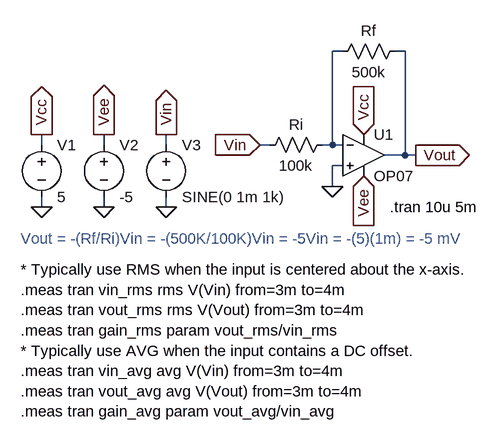
[diagram p0: schematic op-amp_inverting_amplifier.asc]
op-amp_inverting_amplifier.asc, the LTspice schematic file:
Version 4
SHEET 1 1552 680
WIRE 416 160 400 160
WIRE 512 160 496 160
WIRE -48 304 -48 288
WIRE 48 304 48 288
WIRE 144 304 144 288
WIRE 304 304 288 304
WIRE 400 304 400 160
WIRE 400 304 384 304
WIRE 416 304 400 304
WIRE 512 320 512 160
WIRE 512 320 480 320
WIRE 528 320 512 320
WIRE 416 336 400 336
WIRE 400 368 400 336
WIRE -48 400 -48 384
WIRE 48 400 48 384
WIRE 144 400 144 384
FLAG 448 288 Vcc
IOPIN 448 288 In
FLAG 448 352 Vee
IOPIN 448 352 In
FLAG 288 304 Vin
IOPIN 288 304 In
FLAG 528 320 Vout
IOPIN 528 320 Out
FLAG -48 400 0
FLAG 48 400 0
FLAG 144 400 0
FLAG -48 288 Vcc
IOPIN -48 288 Out
FLAG 48 288 Vee
IOPIN 48 288 Out
FLAG 144 288 Vin
IOPIN 144 288 Out
FLAG 400 368 0
SYMBOL OpAmps/OP07 448 256 R0
SYMATTR InstName U1
SYMBOL res 512 144 R90
WINDOW 0 0 56 VBottom 2
WINDOW 3 32 56 VTop 2
SYMATTR InstName Rf
SYMATTR Value 500k
SYMBOL voltage -48 288 R0
SYMATTR InstName V1
SYMATTR Value 5
SYMBOL voltage 48 288 R0
SYMATTR InstName V2
SYMATTR Value -5
SYMBOL voltage 144 288 R0
SYMATTR InstName V3
SYMATTR Value SINE(0 1m 1k)
SYMBOL res 400 288 R90
WINDOW 0 0 56 VBottom 2
WINDOW 3 32 56 VTop 2
SYMATTR InstName Ri
SYMATTR Value 100k
TEXT -80 496 Left 2 !* Typically use RMS when the input is centered about the x-axis.\n.meas tran vin_rms rms V(Vin) from=3m to=4m\n.meas tran vout_rms rms V(Vout) from=3m to=4m\n.meas tran gain_rms param vout_rms/vin_rms\n* Typically use AVG when the input contains a DC offset.\n.meas tran vin_avg avg V(Vin) from=3m to=4m\n.meas tran vout_avg avg V(Vout) from=3m to=4m\n.meas tran gain_avg param vout_avg/vin_avg
TEXT -80 448 Left 2 ;Vout = -(Rf/Ri)Vin = -(500K/100K)Vin = -5Vin = -(5)(1m) = -5 mV
TEXT 488 400 Left 2 !.tran 10u 5m

The netlist it stands for:
* op-amp_inverting_amplifier.asc
XU1 0 N001 Vcc Vee Vout LT1001  ; OP07, pins In+ In- V+ V- OUT
Rf Vout N001 500k
V1 Vcc 0 5
V2 Vee 0 -5
V3 Vin 0 SINE(0 1m 1k)
Ri N001 Vin 100k
* Typically use RMS when the input is centered about the x-axis.
.meas tran vin_rms rms V(Vin) from=3m to=4m
.meas tran vout_rms rms V(Vout) from=3m to=4m
.meas tran gain_rms param vout_rms/vin_rms
* Typically use AVG when the input contains a DC offset.
.meas tran vin_avg avg V(Vin) from=3m to=4m
.meas tran vout_avg avg V(Vout) from=3m to=4m
.meas tran gain_avg param vout_avg/vin_avg
* Vout = -(Rf/Ri)Vin = -(500K/100K)Vin = -5Vin = -(5)(1m) = -5 mV
.tran 10u 5m
.lib LTC.lib
.backanno
.end